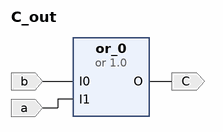
[diagram p0: block diagram of the top level]
# Vivado block design C_out, xc7a35tcpg236-1, Vivado 2018.3
create_bd_design C_out

create_bd_port -dir I -type data b
create_bd_port -dir I -type data a
create_bd_port -dir O -type data C

create_bd_cell -type ip -vlnv FIT:user:or:1.0 or_0

# ---- connections ----

connect_bd_net -net I0_0_1 [get_bd_ports b] [get_bd_pins or_0/I0]
connect_bd_net -net I1_0_1 [get_bd_ports a] [get_bd_pins or_0/I1]
connect_bd_net [get_bd_pins or_0/O] [get_bd_ports C]

validate_bd_design
save_bd_design
